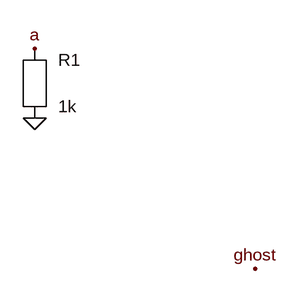
[diagram p0: schematic floating_label.asc]
floating_label.asc, the LTspice schematic file:
Version 4
SHEET 1 880 680
SYMBOL res 96 144 R0
SYMATTR InstName R1
SYMATTR Value 1k
FLAG 96 96 a
FLAG 96 192 0
FLAG 400 400 ghost

The netlist it stands for:
* floating_label.asc
R1 a 0 1k
.backanno
.end